# Altium schematic sheet Hopper.SchDoc
size 420 x 297 mm; SheetNumber: 1; SheetTotal: 1
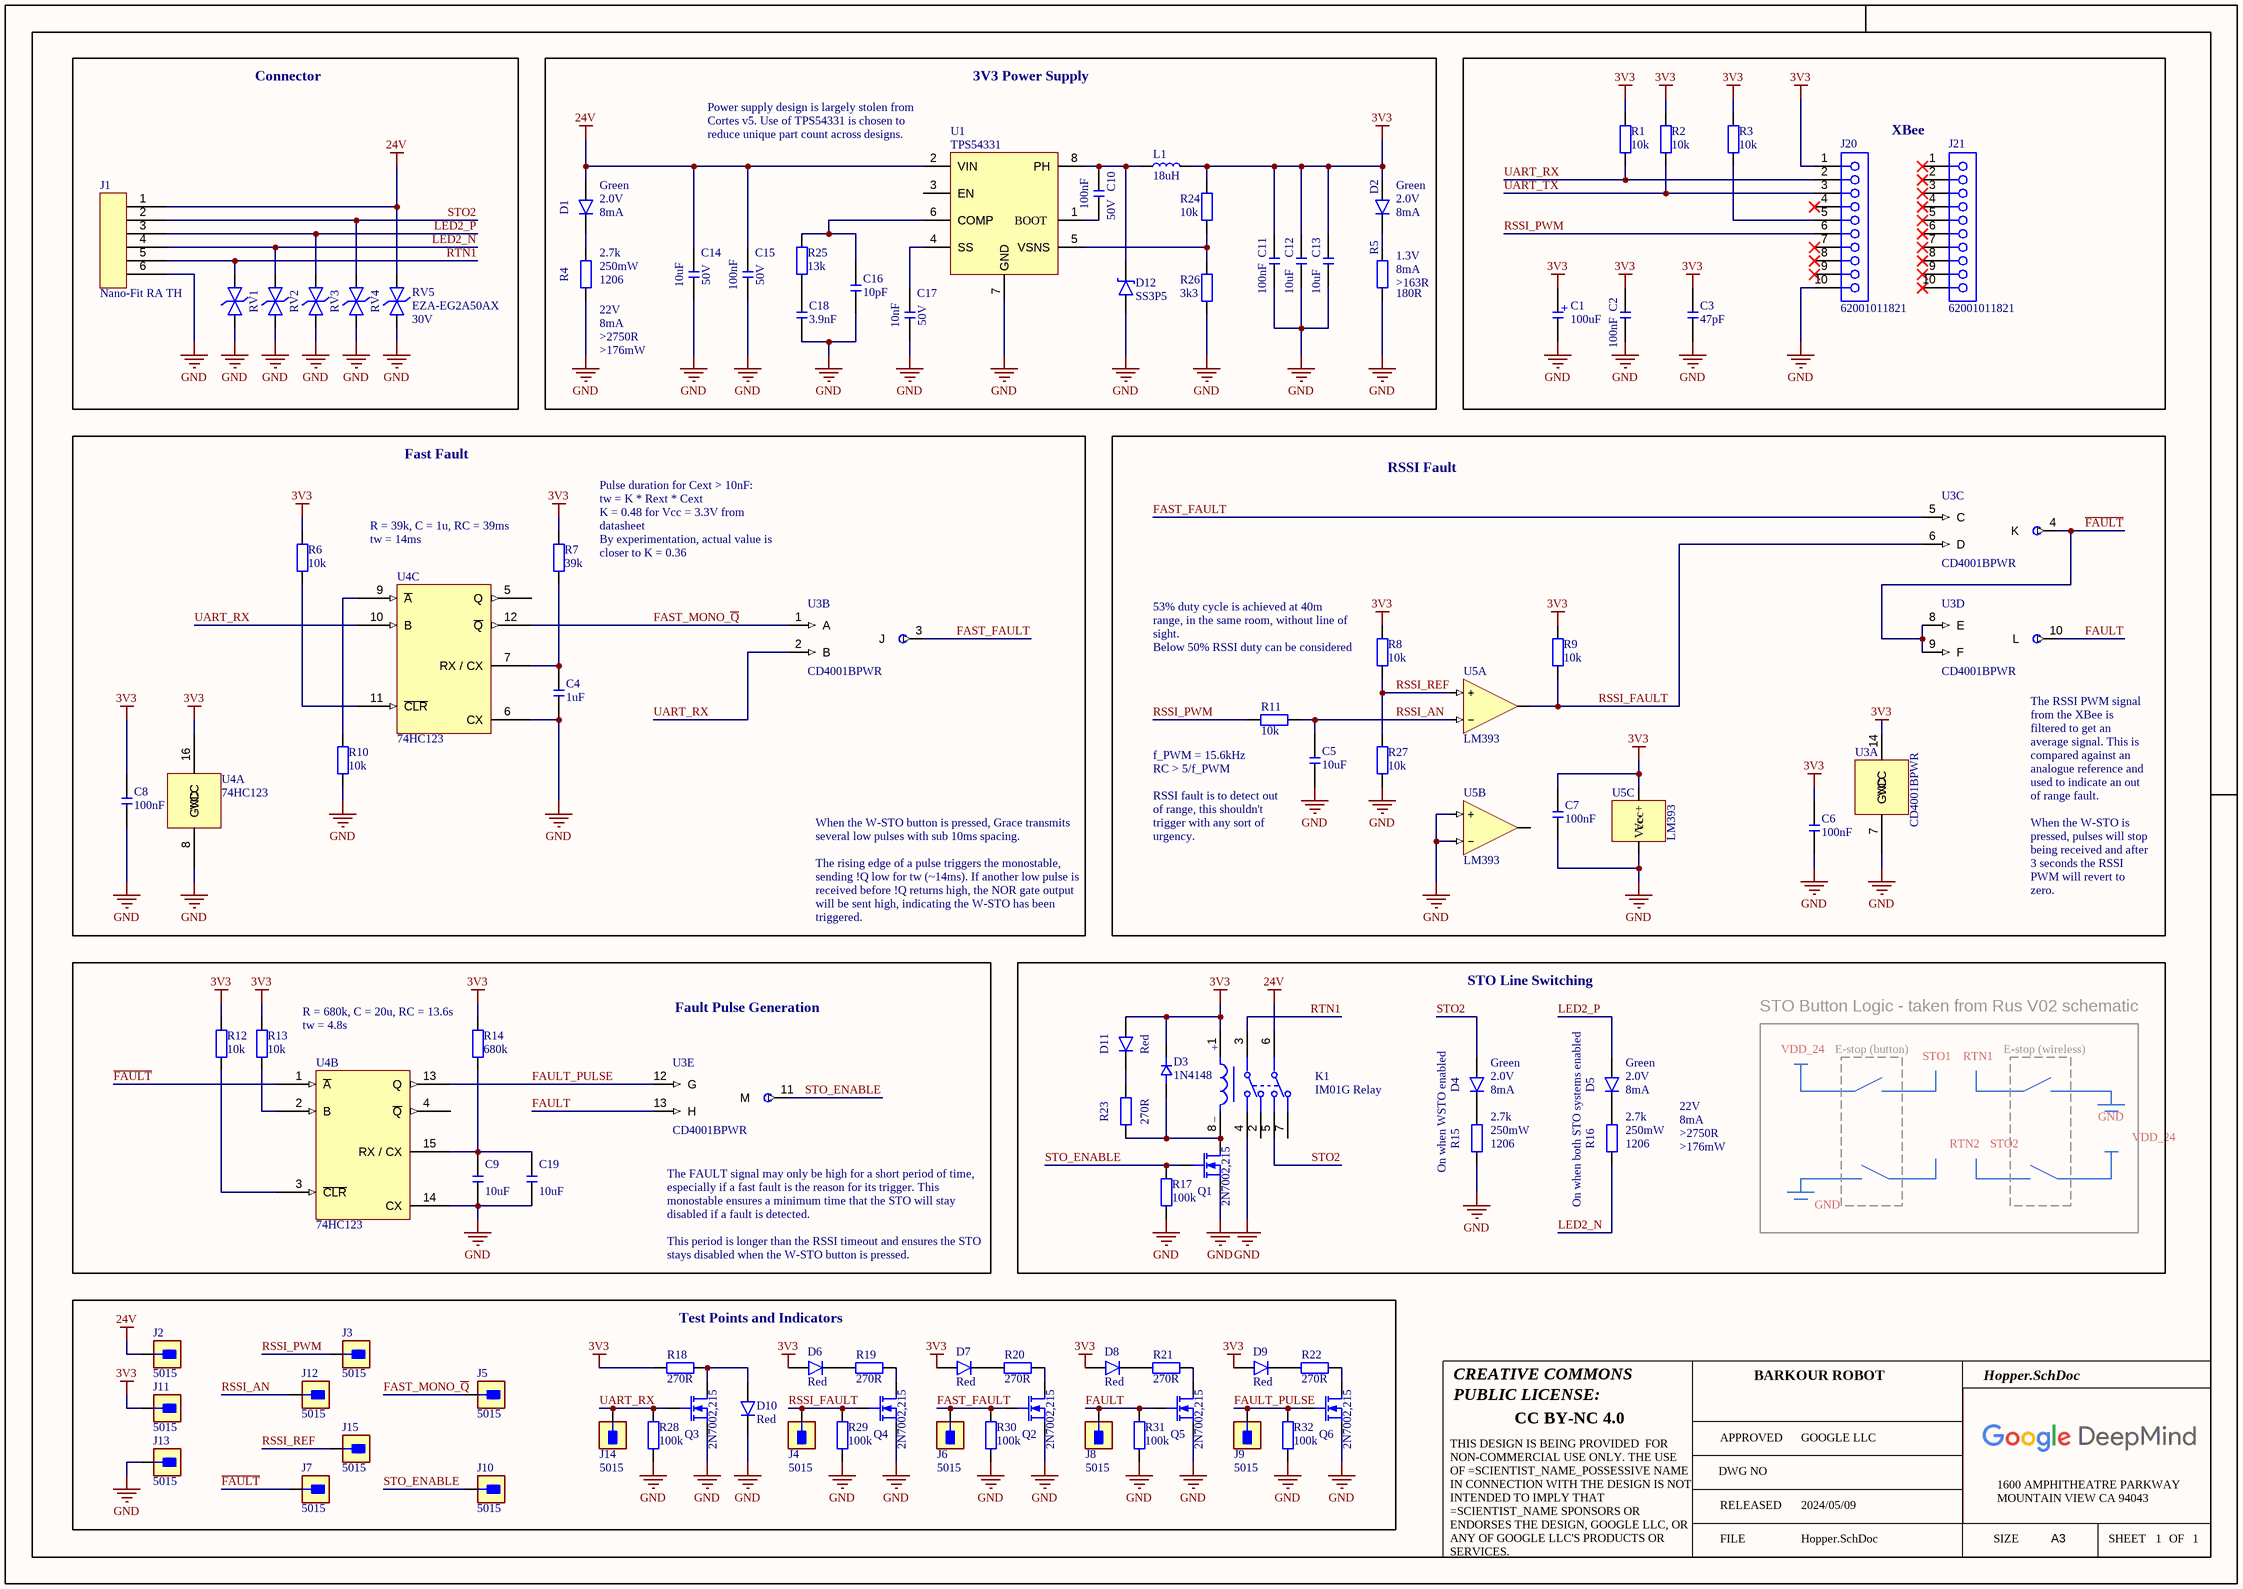
[diagram p0: Hopper.SchDoc]

## Parts
C1  100uF  [CAP ALSMD ELEC 5.3MM H5.8MM]
C2  100nF  [CAP 0402_1005 RF]
C3  47pF  [CAP 0603_1608 RF]
C4  1uF  [CAP 0603_1608 RF]
C5  10uF  [CAP 0603_1608 RF]
C6  100nF  [CAP 0603_1608 RF]
C7  100nF  [CAP 0603_1608 RF]
C8  100nF  [CAP 0603_1608 RF]
C9  10uF  [CAP 0402_1005]
C10  100nF  Voltage Rating: 50V  [CAP 0402_1005 RF]
C11  100nF  [CAP 0402_1005 RF]
C12  10uF  [CAP 0402_1005 RF]
C13  10uF  [CAP 0402_1005 RF]
C14  10uF  Voltage Rating: 50V  [CAP 1206_3216]
C15  100nF  Voltage Rating: 50V  [CAP 0402_1005 RF]
C16  10pF  [CAP 0402_1005 RF]
C17  10nF  Voltage Rating: 50V  [CAP 0402_1005 RF]
C18  3.9nF  [CAP 0402_1005 RF]
C19  10uF  [CAP 0402_1005]
D1  Forward Voltage: 2.0V  Colour: Green  [LED 0402_1005 GREEN]  (hidden comment: 150040VS73240)
D2  Forward Voltage: 2.0V  Colour: Green  [LED 0402_1005 GREEN]  (hidden comment: 150040VS73240)
D3  1N4148  [SOD323]
D4  Forward Voltage: 2.0V  Colour: Green  [LED 0402_1005 GREEN]  (hidden comment: 150040VS73240)
D5  Forward Voltage: 2.0V  Colour: Green  [LED 0402_1005 GREEN]  (hidden comment: 150040VS73240)
D6  Colour: Red  [LED 0402_1005 RED]  (hidden comment: 150040RS73240)
D7  Colour: Red  [LED 0402_1005 RED]  (hidden comment: 150040RS73240)
D8  Colour: Red  [LED 0402_1005 RED]  (hidden comment: 150040RS73240)
D9  Colour: Red  [LED 0402_1005 RED]  (hidden comment: 150040RS73240)
D10  Colour: Red  [LED 0402_1005 RED]  (hidden comment: 150040RS73240)
D11  Colour: Red  [LED 0402_1005 RED]  (hidden comment: 150040RS73240)
D12  Colloquial: SS3P5  [DO-220AA]  (hidden comment: SS3P5-M3/84A)
J1  Colloquial: Nano-Fit RA TH  [MOLEX 1053141206]  (hidden comment: 105314-1206)
J2  5015  [FP-5015-MFG-RF]
J3  5015  [FP-5015-MFG-RF]
J4  5015  [FP-5015-MFG-RF]
J5  5015  [FP-5015-MFG-RF]
J6  5015  [FP-5015-MFG-RF]
J7  5015  [FP-5015-MFG-RF]
J8  5015  [FP-5015-MFG-RF]
J9  5015  [FP-5015-MFG-RF]
J10  5015  [FP-5015-MFG-RF]
J11  5015  [FP-5015-MFG-RF]
J12  5015  [FP-5015-MFG-RF]
J13  5015  [FP-5015-MFG-RF]
J14  5015  [FP-5015-MFG-RF]
J15  5015  [FP-5015-MFG-RF]
J20  62001011821  [62001011821]
J21  62001011821  [62001011821]
K1  Colloquial: IM01G Relay  [TE IM Relay Gullwing]  (hidden comment: 1462037-1)
L1  Inductance: 18uH  [INDUCTOR SMD SHIELDED 10x10mm]  (hidden comment: SRR1050A-180Y)
Q1  2N7002,215  [NEXPERIA SOT-23-3]
Q2  2N7002,215  [NEXPERIA SOT-23-3]
Q3  2N7002,215  [NEXPERIA SOT-23-3]
Q4  2N7002,215  [NEXPERIA SOT-23-3]
Q5  2N7002,215  [NEXPERIA SOT-23-3]
Q6  2N7002,215  [NEXPERIA SOT-23-3]
R1  10k  [RES 0402_1005 RF]
R2  10k  [RES 0402_1005 RF]
R3  10k  [RES 0402_1005 RF]
R4  2.7k  Size Code: 1206  Power Rating: 250mW  [RES 1206_3216 RF]
R5  180R  [RES 0402_1005 RF]
R6  10k  [RES 0402_1005 RF]
R7  39k  [RES 0603_1608 RF]
R8  10k  [RES 0402_1005 RF]
R9  10k  [RES 0402_1005 RF]
R10  10k  [RES 0402_1005 RF]
R11  10k  [RES 0402_1005 RF]
R12  10k  [RES 0402_1005 RF]
R13  10k  [RES 0402_1005 RF]
R14  680k  [RES 0603_1608 RF]
R15  2.7k  Size Code: 1206  Power Rating: 250mW  [RES 1206_3216 RF]
R16  2.7k  Size Code: 1206  Power Rating: 250mW  [RES 1206_3216 RF]
R17  100k  [RES 0402_1005 RF]
R18  270R  [RES 0402_1005 RF]
R19  270R  [RES 0402_1005 RF]
R20  270R  [RES 0402_1005 RF]
R21  270R  [RES 0402_1005 RF]
R22  270R  [RES 0402_1005 RF]
R23  270R  [RES 0402_1005 RF]
R24  10k  [RES 0402_1005 RF]
R25  13k  [RES 0402_1005 RF]
R26  3k3  [RES 0402_1005 RF]
R27  10k  [RES 0402_1005 RF]
R28  100k  [RES 0402_1005 RF]
R29  100k  [RES 0402_1005 RF]
R30  100k  [RES 0402_1005 RF]
R31  100k  [RES 0402_1005 RF]
R32  100k  [RES 0402_1005 RF]
RV1  EZA-EG2A50AX  [RES 0402_1005]  (value not drawn)
RV2  EZA-EG2A50AX  [RES 0402_1005]  (value not drawn)
RV3  EZA-EG2A50AX  [RES 0402_1005]  (value not drawn)
RV4  EZA-EG2A50AX  [RES 0402_1005]  (value not drawn)
RV5  EZA-EG2A50AX  Operating Supply Voltage: 30V  [RES 0402_1005]
U1  Colloquial: TPS54331  [TI SOIC-8 D0008A]  (hidden comment: TPS54331GDR)
U3  CD4001BPWR  [TI TSSOP-14 PW]  (parts A,B,C,D,E of 5)
U4  CD74HC123PW  [TI TSSOP-16 PW]  (value not drawn)  (parts A,B,C of 3)
U5  LM393PT  [ST TSSOP-8]  (value not drawn)  (parts A,B,C of 3)

## Blocks framed on the sheet
Connector: J1 RV1-RV5
3V3 Power Supply: C10-C18 D1 D2 D12 L1 R4 R5 R24-R26 U1
XBee: C1-C3 J20 J21 R1-R3
Fast Fault: C4 C8 R6 R7 R10 U3 U4
RSSI Fault: C5-C7 R8 R9 R11 R27 U3 U5
Fault Pulse Generation: C9 C19 R12-R14 U3 U4
STO Button Logic - taken from Rus V02 schematic: D3-D5 D11 K1 Q1 R15-R17 R23
Test Points and Indicators: D6-D10 J2-J15 Q2-Q6 R18-R22 R28-R32

## Nets
3V3: C1.1 C2.2 C3.2 C6.2 C7.2 C8.2 C11.2 C12.2 C13.2 D2.1(+) D3.2 D6.1(+) D7.1(+) D8.1(+) D9.1(+) D11.1(+) J11.1 J20.1 K1.1 L1.2 R1.2 R2.2 R3.2 R6.2 R7.2 R8.2 R9.2 R12.2 R13.2 R14.2 R18.2 R24.2 U3.14(VCC) U4.16(VCC) U5.8(Vcc+)
24V: C14.2 C15.2 D1.1(+) J1.1 J2.1 K1.6 RV5.2 U1.2(VIN)
GND: C1.2 C2.1 C3.1 C4.1 C5.1 C6.1 C7.1 C8.1 C9.1 C11.1 C12.1 C13.1 C14.1 C15.1 C16.2 C17.1 C18.1 C19.1 D10.2(-) D12.1(A) J1.6 J13.1 J20.10 K1.4 Q1.2(S) Q2.2(S) Q3.2(S) Q4.2(S) Q5.2(S) Q6.2(S) R4.1 R5.1 R10.1 R15.1 R17.1 R26.1 R27.1 R28.1 R29.1 R30.1 R31.1 R32.1 RV1.1 RV2.1 RV3.1 RV4.1 RV5.1 U1.7(GND) U3.7(GND) U4.6(CX) U4.8(GND) U4.14(CX) U5.4(Vcc-) U5.5(+) U5.6(−)
~{FAULT}: J7.1 U3.4(K) U3.8(E) U3.9(F) U4.1(~{A})
FAST_FAULT: J6.1 Q2.1(G) R30.2 U3.3(J) U3.5(C)
FAST_MONO_~{Q}: J5.1 U3.1(A) U4.12(~{Q})
FAULT: J8.1 Q5.1(G) R31.2 U3.10(L) U3.13(H)
FAULT_PULSE: J9.1 Q6.1(G) R32.2 U3.12(G) U4.13(Q)
LED2_N: J1.4 R16.1 RV2.2
LED2_P: D5.1(+) J1.3 RV3.2
RSSI_AN: C5.2 J12.1 R11.2 U5.2(−)
RSSI_FAULT: J4.1 Q4.1(G) R9.1 R29.2 U3.6(D) U5.1(Out1)
RSSI_PWM: J3.1 J20.6 R11.1
RSSI_REF: J15.1 R8.1 R27.2 U5.3(+)
RTN1: J1.5 K1.3 RV1.2
STO2: D4.1(+) J1.2 K1.5 RV4.2
STO_ENABLE: J10.1 Q1.1(G) R17.2 U3.11(M)
UART_RX: J14.1 J20.2 Q3.1(G) R1.1 R28.2 U3.2(B) U4.10(B)
UART_TX: J20.3 R2.1
NetC4_2: C4.2 R7.1 U4.7(RX_/_CX)
NetC9_2: C9.2 C19.2 R14.1 U4.15(RX_/_CX)
NetC10_1: C10.1 U1.1(BOOT)
NetC10_2: C10.2 D12.2(K) L1.1 U1.8(PH)
NetC16_1: C16.1 R25.2 U1.6(COMP)
NetC17_2: C17.2 U1.4(SS)
NetC18_2: C18.2 R25.1
NetD1_2: D1.2(-) R4.2
NetD2_2: D2.2(-) R5.2
NetD3_1: D3.1 K1.8 Q1.3(D) R23.1
NetD4_2: D4.2(-) R15.2
NetD5_2: D5.2(-) R16.2
NetD6_2: D6.2(-) R19.2
NetD7_2: D7.2(-) R20.2
NetD8_2: D8.2(-) R21.2
NetD9_2: D9.2(-) R22.2
NetD10_1: D10.1(+) Q3.3(D) R18.1
NetD11_2: D11.2(-) R23.2
NetJ20_5: J20.5 R3.1
NetQ2_3: Q2.3(D) R20.1
NetQ4_3: Q4.3(D) R19.1
NetQ5_3: Q5.3(D) R21.1
NetQ6_3: Q6.3(D) R22.1
NetR6_1: R6.1 U4.11(~{CLR})
NetR10_2: R10.2 U4.9(~{A})
NetR12_1: R12.1 U4.3(~{CLR})
NetR13_1: R13.1 U4.2(B)
NetR24_1: R24.1 R26.2 U1.5(VSNS)

Not connected (* = marked no-connect by the designer): J20 4* 7* 8* 9*; J21 1* 2* 3* 4* 5* 6* 7* 8* 9* 10*; K1 2 7; U1 3(EN); U4 4(~{Q}) 5(Q); U5 7(Out1)

## Notes on the sheet
- (near U1) Power supply design is largely stolen from Cortes v5. Use of TPS54331 is chosen to reduce unique part count across designs.
- (near D1) 8mA
- (near D2) 8mA
- (near R5) 1.3V
  8mA
  >163R
- (near R4) 22V
  8mA
  >2750R
  >176mW
- R = 39k, C = 1u, RC = 39ms
  tw = 14ms
- (near R7) Pulse duration for Cext > 10nF:
  tw = K * Rext * Cext
  K = 0.48 for Vcc = 3.3V from datasheet
  By experimentation, actual value is closer to K = 0.36
- (near R8) 53% duty cycle is achieved at 40m range, in the same room, without line of sight.
  Below 50% RSSI duty can be considered "out of range" and trigger a fault.
- f_PWM = 15.6kHz
  RC > 5/f_PWM
  RSSI fault is to detect out of range, this shouldn't trigger with any sort of urgency.
- When the W-STO button is pressed, Grace transmits several low pulses with sub 10ms spacing.
  The rising edge of a pulse triggers the monostable, sending !Q low for tw (~14ms). If another low pulse is received before !Q returns high, the NOR gate output will be sent high, indicating the W-STO has been triggered.
- (near U3) The RSSI PWM signal from the XBee is filtered to get an average signal. This is compared against an analogue reference and used to indicate an out of range fault.
  When the W-STO is pressed, pulses will stop being received and after 3 seconds the RSSI PWM will revert to zero.
- STO Line Switching
- R = 680k, C = 20u, RC = 13.6s
  tw = 4.8s
- On when both STO systems enabled
- VDD_24
- E-stop (button)
- STO1
- RTN1
- E-stop (wireless)
- On when WSTO enabled
- (near D4) 8mA
- (near D5) 8mA
- GND
- 22V
  8mA
  >2750R
  >176mW
- RTN2
- STO2
- The FAULT signal may only be high for a short period of time, especially if a fast fault is the reason for its trigger. This monostable ensures a minimum time that the STO will stay disabled if a fault is detected.
  This period is longer than the RSSI timeout and ensures the STO stays disabled when the W-STO button is pressed.
- CREATIVE COMMONS
- PUBLIC LICENSE:
- BARKOUR ROBOT
- CC BY-NC 4.0
- APPROVED
- DWG NO
- GOOGLE LLC
- FILE
- RELEASED
- 2024/05/09
- SIZE
- 1600 AMPHITHEATRE PARKWAY
- MOUNTAIN VIEW CA 94043
- A3
- SHEET
- OF
- THIS DESIGN IS BEING PROVIDED  FOR NON-COMMERCIAL USE ONLY. THE USE OF =SCIENTIST_NAME_POSSESSIVE NAME IN CONNECTION WITH THE DESIGN IS NOT INTENDED TO IMPLY THAT =SCIENTIST_NAME SPONSORS OR ENDORSES THE DESIGN, GOOGLE LLC, OR ANY OF GOOGLE LLC'S PRODUCTS OR SERVICES.
- (in symbol C_POL) +
- (in symbol IM01G) +; −

## Library data of the parts
C1 = C_POL: Generic Polarised Capacitor; Tolerance: 20%; Voltage Rating: 16V; Capacitance: 100uF; Diameter: 5mm; Height: 5.8mm; Size Code: D5.0 x H5.8
C2 C11 C18 = C: Generic Capacitor; Tolerance: 10%; Temperature Coefficient: X7R; Voltage Rating: 50V; Size Code: 0402
  C2 C11: Capacitance: 100nF
  C18: Capacitance: 3.9nF
C3 = C: Capacitor; Tolerance: 20%; Dielectric: C0G; Voltage Rating: 50V; Capacitance: 47pF; Size Code: 0603
C4 = C: Capacitor; Tolerance: 20%; Dielectric: X7R; Voltage Rating: 10V; Capacitance: 1uF; Size Code: 0603
C5 = C: Capacitor; Tolerance: 10%; Dielectric: X5R; Voltage Rating: 10V; Capacitance: 10uF; Size Code: 0603
C6-C8 = C: Capacitor; Tolerance: 20%; Dielectric: X7R; Voltage Rating: 25V; Capacitance: 100nF; Size Code: 0603
C9 C12 C13 C19 = C: Generic Capacitor; Tolerance: 20%; Temperature Coefficient: X5R; Voltage Rating: 6.3V; Capacitance: 10uF; Size Code: 0402
C10 C15 C17 = C: Generic Capacitor; Tolerance: 10%; Temperature Coefficient: X7R; Size Code: 0402
  C10 C15: Capacitance: 100nF
  C17: Capacitance: 10nF
C14 = C: Generic Capacitor; Tolerance: 10%; Temperature Coefficient: X5R; Capacitance: 10uF; Size Code: 1206
C16 = C: Generic Capacitor; Tolerance: 5%; Temperature Coefficient: C0G; Voltage Rating: 50V; Capacitance: 10pF; Size Code: 0402
D1 D2 D4 D5 = LED_GREEN_0402: Green SMD LED, 0402, 20mA Ic, 2V; Wavelength: 570nm; Luminous Intensity: 50mcd; Case Size: 0402; Manufacturer Part Number: 150040VS73240; Forward Current: 20mA
D3 = 1N4148: Signal Diode VR=75V IF=150mA Trr=4ns P=200mW; Manufacturer: Diodes; Manufacturer Part Number: 1N4148WS-7-F; Reverse Recovery Time: 4ns; Forward Voltage: 1.25V; Average Rectified Current: 150mA; Max Repetitive Reverse Voltage (Vrrm): 75V; Element Configuration: Single; Forward Current: 300mA; Peak Non-Repetitive Surge Current: 2A; Power Dissipation: 200mW; Max Reverse Current: 1uA; Polarity: Standard; Capacitance: 2pF; Supplier 1: RSComponents; RoHS: Yes; Category: Rectifier Diodes; Stock 1: 18000; Pricing 1: 3000=0.03600, 6000=0.03200, 12000=0.02900, 30000=0.02700, 60000=0.02300 (USD); Mount: Surface Mount; Number of Pins: 2; Weight: 0.000173oz; Contact Plating: Tin,Matte; Min Operating Temperature: -65°C; Max Operating Temperature: 150°C; Packaging: Tape and Reel; Max Reverse Voltage (DC): 75V; Recovery Time: 4ns; Package Quantity: 3000; Max Forward Surge Current (Ifsm): 2A; Series: -; Max Surge Current: 2A; Current Rating: 150mA; Voltage Rating (DC): 75V; Output Current: 150mA; Reverse Recovery Time-Max: 4ns; Power Rating: 200mW; Voltage: 75V; Length: 1.8mm; Width: 1.4mm; Height: 1mm; Radiation Hardening: No; Lead Free: Lead Free; RoHS Compliant: Yes; REACH SVHC: No SVHC; Supplier Part Number 1: 9228070; Colloquial: 1N4148
D6-D11 = LED_RED_0402: Red SMD LED, 0402, 20mA Ic, 2V; Wavelength: 625nm; Luminous Intensity: 100mcd; Forward Voltage: 2.0V; Case Size: 0402; Manufacturer Part Number: 150040RS73240; Forward Current: 20mA
D12 = SS3P5-M3/84A: VISHAY   SS3P5-M3/84A   DIODE, RECTIFIER, SCHOTTKY, 3A, 50V, SMP; Max Reverse Current: 100uA; Forward Voltage: 780mV; Max Forward Surge Current (Ifsm): 45A; Element Configuration: Single; Manufacturer: Vishay; Manufacturer Part Number: SS3P5-M3/84A; Supplier 1: RSComponents; RoHS: Yes; Category: Rectifier Diodes; Stock 1: 1; Pricing 1: 10=0.45800, 50=0.45100 (USD); Mount: Surface Mount; Case/Package: DO-220AA; Number of Pins: 2; Weight: 0.000847oz; Min Operating Temperature: -55°C; Max Operating Temperature: 150°C; Forward Current: 3A; Packaging: Tape and Reel; Package Quantity: 3000; Average Rectified Current: 3A; Max Repetitive Reverse Voltage (Vrrm): 50V; Peak Non-Repetitive Surge Current: 45A; Max Reverse Voltage (DC): 50V; Series: eSMP®; Length: 3.61mm; Width: 2.18mm; Height: 1.15mm; Radiation Hardening: No; REACH SVHC: Unknown; RoHS Compliant: Yes; ComponentLink1URL: https://datasheet.ciiva.com/29591/ss3p5-29591977.pdf?src-supplier=Digi-Key; ComponentLink1Description: https://datasheet.ciiva.com/29591/ss3p5-29591977.pdf?src-supplier=Digi-Key; ComponentLink2URL: https://datasheet.ciiva.com/8289/ss3p5-8289162.pdf?src-supplier=Avnet; ComponentLink2Description: https://datasheet.ciiva.com/8289/ss3p5-8289162.pdf?src-supplier=Avnet; ComponentLink3URL: https://datasheet.ciiva.com/7962/ss3p5-7962430.pdf?src-supplier=Element14; ComponentLink3Description: https://datasheet.ciiva.com/7962/ss3p5-7962430.pdf?src-supplier=Element14; Supplier Part Number 1: 7103752P
J1 = Nano-Fit RA TH 6 Way Header Dual Row: Nano-Fit Right Angle Header; Through Hole; 2.50mm; Dual Row; 6 Circuit; Gold Plated; Manufacturer: Molex; Gender: Male; Manufacturer Part Number: 105314-1206; RoHS: Yes; Category: Headers and Wire Housings; Stock 1: 621; Pricing 1: 10=1.38000 (GBP); Mount: Through Hole; Contact Plating: Gold; Contact Material: Brass; Color: Black; Termination: Through Hole; Number of Rows: 2; REACH SVHC: Unknown; RoHS Compliant: Yes; Supplier 1: Farnell; Supplier Part Number 1: 2576871
J2-J15 = 5015: PC TEST POINT MINIATURE; Manufacturer: keystone; Number Of Contacts: 1; Conn Orientation: Straight; Category: Conn; Manufacturer Part Number: 5015; Digikey Description: PC TEST POINT MINIATURE; Automotive: No; Lead Free: Yes; Octopart: https://octopart.com/5015-keystone-3822; ComponentLink2URL: http://www.keyelco.com/product-pdf.cfm?p=1353; Package: 5015; RoHS: TRUE; Device Class L3: unset; Device Class L2: unset; Contact Material: Silver; Device Class L1: Connectors; Height: 1.65mm; ComponentLink2Description: Datasheet
J20 J21 = CMP-1502-01210-2: NexarPartId: 65162168; Current Rating: 2A; Gender: Female; Operating Supply Voltage: 250V; Contact Resistance: 20mΩ; Number of Pins: 10; Orientation: Vertical; Lead Pitch: 2mm; RoHS: Non-Compliant
K1 = IM01G: Signal Relay 3VDC 2A DPDT (( 10mm 7.5mm 5.65mm)) Surface Mount Automotive; Manufacturer: TE Connectivity Axicom; Manufacturer Part Number: 1462037-1; RoHS: Yes; Category: Signal Relays; Stock 1: 745; Pricing 1: 1=2.25000, 100=1.60000, 250=1.45000, 500=1.27000 (GBP)
L1 = SRR1050A-180Y: Inductor Power Shielded Wirewound 18uH 30% 100KHz Ferrite 3.1A 0.051Ohm DCR Automotive T/R; Manufacturer: Bourns; Saturation Current: 3.2A; DC Resistance (DCR): 51mR; Supplier 1: Mouser; Manufacturer Part Number: SRR1050A-180Y; RoHS: Yes; Category: Fixed Inductors; Stock 1: 5557; Pricing 1: 1=1.29000, 10=0.94500, 50=0.94500, 100=0.79400, 1000=0.68100, 10000=0.54800 (USD); Mount: Surface Mount; RMS Current (Irms): 3.1A; Packaging: Cut Tape; Inductance Tolerance: 30%; REACH SVHC: No SVHC; RoHS Compliant: Yes; ComponentLink1URL: https://www.bourns.com/docs/Product-Datasheets/SRR1050A.pdf?src-supplier=Digi-Key; ComponentLink1Description: https://www.bourns.com/docs/Product-Datasheets/SRR1050A.pdf?src-supplier=Digi-Key; ComponentLink2URL: http://www.farnell.com/datasheets/2113225.pdf?src-supplier=Element14; ComponentLink2Description: http://www.farnell.com/datasheets/2113225.pdf?src-supplier=Element14; Supplier Part Number 1: 652-SRR1050A-180Y
Q1-Q6 = 2N7002: MOSFET N-CH 60V 300MA SOT-23; Manufacturer: Nexperia; ComponentLink2URL: https://assets.nexperia.com/documents/data-sheet/BSS138PS.pdf?src-supplier=Digi-Key; ComponentLink2Description: https://assets.nexperia.com/documents/data-sheet/BSS138PS.pdf?src-supplier=Digi-Key; Supplier 1: Arrow Electronics; Manufacturer Part Number: 2N7002,215; RoHS: Yes; Category: MOSFETs; Stock 1: 243000; Pricing 1: 3000=0.05700, 9000=0.05640, 24000=0.05590, 45000=0.05530 (USD); RoHS Compliant: Yes; ComponentLink1URL: http://www.farnell.com/datasheets/1499179.pdf?src-supplier=Farnell; ComponentLink1Description: http://www.farnell.com/datasheets/1499179.pdf?src-supplier=Farnell; ComponentLink3URL: https://assets.nexperia.com/documents/data-sheet/2N7002.pdf?src-supplier=Digi-Key; ComponentLink3Description: https://assets.nexperia.com/documents/data-sheet/2N7002.pdf?src-supplier=Digi-Key; ComponentLink4URL: http://www.farnell.com/datasheets/1499179.pdf?src-supplier=Newark; ComponentLink4Description: http://www.farnell.com/datasheets/1499179.pdf?src-supplier=Newark; Supplier Part Number 1: 2N7002,215
R1-R3 R5 R6 R8-R13 R17-R32 = R: Generic Resistor; Tolerance: 1%; Voltage Rating: 50V; Power Rating: 62.5mW; Temperature Coefficient: 100ppm/°C; Size Code: 0402
  R1-R3 R6 R8-R13 R24 R27: Resistance: 10k
  R5: Resistance: 180R
  R17 R28-R32: Resistance: 100k
  R18-R23: Resistance: 270R
  R25: Resistance: 13k
  R26: Resistance: 3k3
R4 R15 R16 = R: Resistor; Tolerance: 1%; Voltage Rating: 200V; Temperature Coefficient: 100ppm/°C; Resistance: 2.7k
R7 R14 = R: Resistor; Tolerance: 1%; Voltage Rating: 75V; Power Rating: 100mW; Temperature Coefficient: 100ppm/°C; Size Code: 0603
  R7: Resistance: 39k
  R14: Resistance: 680k
RV1-RV4 = EZA-EG2A50AX: EZAEG Series 100 Vcl 0.05 pF 0402 Surface Mount ESD Suppressor; Manufacturer: Panasonic; Capacitance: 0.1pF; Direction: Bidirectional; Current Rating: 2A; Number of Circuits: 1; Max Voltage Rating (DC): 30V; Clamping Voltage: 100V; Working Voltage: 500V; ESD Protection: Yes; Element Configuration: Single; Voltage Rating (DC): 15V; Supplier 1: Arrow Electronics; RoHS: Yes; Category: Varistors; Stock 1: 5580; Pricing 1: 1=0.35820, 10=0.30530, 25=0.26250, 100=0.22160, 250=0.18290, 500=0.15520, 1000=0.12540, 3000=0.11050 (USD); Mount: Surface Mount; Case/Package: 0402; Number of Pins: 2; Case Code (Metric): 1005; Case Code (Imperial): 0402; Min Operating Temperature: -55°C; Max Operating Temperature: 125°C; Package Quantity: 1; Packaging: Tape and Reel; Polarity: Bidirectional; Number of Channels: 1; Termination: SMD/SMT; Test Current: 2A; Breakdown Voltage: 15V; Series: -; Length: 1mm; Width: 0.02inch; Height: 0.015inch; Depth: 0.5mm; Radiation Hardening: No; REACH SVHC: Unknown; Lead Free: Lead Free; RoHS Compliant: Yes; Supplier Part Number 1: EZA-EG2A50AX; Manufacturer Part Number: EZA-EG2A50AX
RV5 = EZA-EG2A50AX: EZAEG Series 100 Vcl 0.05 pF 0402 Surface Mount ESD Suppressor; Manufacturer: Panasonic; Capacitance: 0.1pF; Direction: Bidirectional; Current Rating: 2A; Number of Circuits: 1; Clamping Voltage: 100V; Working Voltage: 500V; ESD Protection: Yes; Element Configuration: Single; Voltage Rating (DC): 15V; Supplier 1: Arrow Electronics; RoHS: Yes; Category: Varistors; Stock 1: 5580; Pricing 1: 1=0.35820, 10=0.30530, 25=0.26250, 100=0.22160, 250=0.18290, 500=0.15520, 1000=0.12540, 3000=0.11050 (USD); Mount: Surface Mount; Case/Package: 0402; Number of Pins: 2; Case Code (Metric): 1005; Case Code (Imperial): 0402; Min Operating Temperature: -55°C; Max Operating Temperature: 125°C; Package Quantity: 1; Packaging: Tape and Reel; Max Voltage Rating (DC): 30V; Polarity: Bidirectional; Number of Channels: 1; Termination: SMD/SMT; Test Current: 2A; Breakdown Voltage: 15V; Series: -; Length: 1mm; Width: 0.02inch; Height: 0.015inch; Depth: 0.5mm; Radiation Hardening: No; REACH SVHC: Unknown; Lead Free: Lead Free; RoHS Compliant: Yes; Supplier Part Number 1: EZA-EG2A50AX; Manufacturer Part Number: EZA-EG2A50AX
U1 = TPS54331GDR: 3.5V to 28V Input, 3A, 570kHz Step-Down Converter with Eco-mode 8-SOIC -40 to 150; Manufacturer: Texas Instruments; Output Voltage: 25V; Number of Outputs: 1; Synchronous Rectifier: No; Quiescent Current: 110uA; Min Output Voltage: 800mV; Output Type: Adjustable; Manufacturer Part Number: TPS54331GDR; Supplier 1: Mouser; RoHS: Yes; Category: Voltage Regulators - Switching; Pricing 1: 1=1.85000, 10=1.67000, 25=1.57000, 50=1.57000, 100=1.34000, 250=1.26000, 500=1.10000, 1000=0.91100, 2500=0.91000, 10000=0.91000 (USD); Case/Package: D; Number of Pins: 8; Min Operating Temperature: -40°C; Max Operating Temperature: 150°C; Output Current: 3A; Package Quantity: 2500; Switching Frequency: 570kHz; Series: SWIFT™, Eco-Mode™; Packaging: Tape and Reel; Max Output Current: 3A; Max Input Voltage: 28V; Min Input Voltage: 3.5V; Max Output Voltage: 25V; Operating Supply Voltage: 28V; Lead Free: Lead Free; RoHS Compliant: Yes; ComponentLink1URL: https://datasheet.ciiva.com/14378/tps54331-14378086.pdf?src-supplier=Avnet; ComponentLink1Description: https://datasheet.ciiva.com/14378/tps54331-14378086.pdf?src-supplier=Avnet; ComponentLink2URL: https://datasheet.ciiva.com/2034/tps54331-2034843.pdf?src-supplier=Digi-Key; ComponentLink2Description: https://datasheet.ciiva.com/2034/tps54331-2034843.pdf?src-supplier=Digi-Key; Supplier Part Number 1: 595-TPS54331GDR
U3 = CD4001BPWR: 4-ch, 2-input, 3-V to 18-V NOR gates 14-TSSOP -55 to 125; Manufacturer: Texas Instruments; Min Supply Voltage: 3V; Max Supply Voltage: 18V; Propagation Delay: 90ns; Number of Outputs: 1; Number of Gates: 4; Low Level Output Current: 4.2mA; Quiescent Current: 5uA; High Level Output Current: -4.2mA; Output Current: 6.8mA; Number of Inputs: 2; Colloquial: 4001; Manufacturer Part Number: CD4001BPWR; RoHS: Yes; Category: Logic Gates; Pricing 1: 1=0.59000, 10=0.50200, 50=0.50200, 100=0.34800, 1000=0.22800, 10000=0.20700 (USD); Mount: Surface Mount; Case/Package: TSSOP; Number of Pins: 14; Contact Plating: Gold; Weight: 0.002018oz; Min Operating Temperature: -55°C; Max Operating Temperature: 125°C; Packaging: Tape and Reel; Logic Function: NOR GATE; Number of Elements: 4; Number of Bits: 4; Turn-On Delay Time: 90ns; Package Quantity: 1; Number of Input Lines: 2; Number of Output Lines: 1; Number of Circuits: 4; Technology: CMOS; Series: 4000B; Radiation Hardening: No; Lead Free: Lead Free; RoHS Compliant: Yes; REACH SVHC: No SVHC; Supplier 1: Mouser; Supplier 2: Digi-Key; Supplier 3: Digi-Key; Supplier Part Number 3: NLV14001BDTR2G-ND; Supplier Part Number 2: 296-32851-5-ND; Supplier Part Number 1: 595-CD4001BPWR
U4 = 74HC123: High Speed CMOS Logic Dual etriggerable Monostable Multivibrators with eset 16-TSSOP -55 to 125; Propagation Delay: 25ns; Number of Elements: 2; Max Supply Voltage: 6V; Min Supply Voltage: 2V; Output Current: 5.2mA; Operating Supply Voltage: 5V; High Level Output Current: -5.2mA; Turn-On Delay Time: 54ns; Quiescent Current: 8uA; Schmitt Trigger Input: Yes; Supplier 1: Mouser; Supplier 2: Mouser; Supplier Part Number 1: 595-CD74HC123PW; Supplier Part Number 2: 771-74HC123PW-T; RoHS: Yes; Category: Timers and Oscillators; Stock 1: 1774; Pricing 1: 1=1.19000, 10=1.08000, 50=1.02000, 100=0.83600, 1000=0.69000, 10000=0.52700 (USD); Mount: Surface Mount; Case/Package: TSSOP; Number of Pins: 16; Weight: 0.002183oz; Min Operating Temperature: -55°C; Max Operating Temperature: 125°C; Package Quantity: 90; Packaging: Rail/Tube; Low Level Output Current: 5.2mA; Logic Function: Multivibrator; Independent Circuits: 2; Number of Bits: 2; Length: 5mm; Width: 4.4mm; Height: 1.15mm; Radiation Hardening: No; Lead Free: Lead Free; REACH SVHC: No SVHC; Colloquial: 74HC123; Manufacturer Part Number: CD74HC123PW
U5 = LM393: Comparator Dual 18V/36V 8-Pin TSSOP T/R; Manufacturer: ST; Voltage Gain: 106.02dB; Min Supply Voltage: 2V; Max Supply Voltage: 36V; Min Dual Supply Voltage: 1V; Max Dual Supply Voltage: 18V; Number of Elements: 2; Input Offset Voltage (Vos): 5mV; Input Bias Current: 250nA; Output Current: 18mA; Quiescent Current: 2.5mA; Output Type: TTL; Max Power Dissipation: 625mW; Nominal Supply Current: 1mA; Output Current per Channel: 100pA; Response Time: 1.3us; Natural Thermal Resistance: 120°C/W; Manufacturer Part Number: LM393PT; Supplier 1: Newark; RoHS: Yes; Category: Comparators; Stock 1: 4000; Pricing 1: 1=0.55700, 5=0.55700, 10=0.47600, 25=0.44300, 50=0.37500, 100=0.30600, 250=0.25300, 500=0.20100, 1000=0.16500 (USD); Mount: Surface Mount; Case/Package: TSSOP; Number of Pins: 8; Min Operating Temperature: 0°C; Max Operating Temperature: 70°C; Package Quantity: 1; Packaging: Tape and Reel; Type: General Purpose; Number of Channels: 2; Max Input Current: 250nA; Max Supply Current: 1mA; Power Dissipation: 625mW; Supply Current: 1mA; Series: LM393; Technology: BIPOLAR; Radiation Hardening: No; RoHS Compliant: Yes; Lead Free: Lead Free; ComponentLink1URL: https://datasheet.ciiva.com/15131/getdatasheetpartid-186418-15131021.pdf?src-supplier=Verical; ComponentLink1Description: https://datasheet.ciiva.com/15131/getdatasheetpartid-186418-15131021.pdf?src-supplier=Verical; ComponentLink2URL: https://datasheet.ciiva.com/1827/cd00000465-1827201.pdf?src-supplier=Digi-Key; ComponentLink2Description: https://datasheet.ciiva.com/1827/cd00000465-1827201.pdf?src-supplier=Digi-Key; ComponentLink3URL: https://datasheet.ciiva.com/1827/cd00000465-1827202.pdf?src-supplier=Digi-Key; ComponentLink3Description: https://datasheet.ciiva.com/1827/cd00000465-1827202.pdf?src-supplier=Digi-Key; ComponentLink4URL: https://datasheet.ciiva.com/1827/cd00000465-1827203.pdf?src-supplier=Digi-Key; ComponentLink4Description: https://datasheet.ciiva.com/1827/cd00000465-1827203.pdf?src-supplier=Digi-Key; ComponentLink5URL: https://datasheet.ciiva.com/2971/cd00000465-2971959.pdf?src-supplier=Avnet; ComponentLink5Description: https://datasheet.ciiva.com/2971/cd00000465-2971959.pdf?src-supplier=Avnet; ComponentLink6URL: https://datasheet.ciiva.com/16381/cd00000465-16381559.pdf?src-supplier=Future+Electronics; ComponentLink6Description: https://datasheet.ciiva.com/16381/cd00000465-16381559.pdf?src-supplier=Future+Electronics; Supplier Part Number 1: 69AH0634; Colloquial: LM393